# EAGLE design Forza (EAGLE 9.6.2)
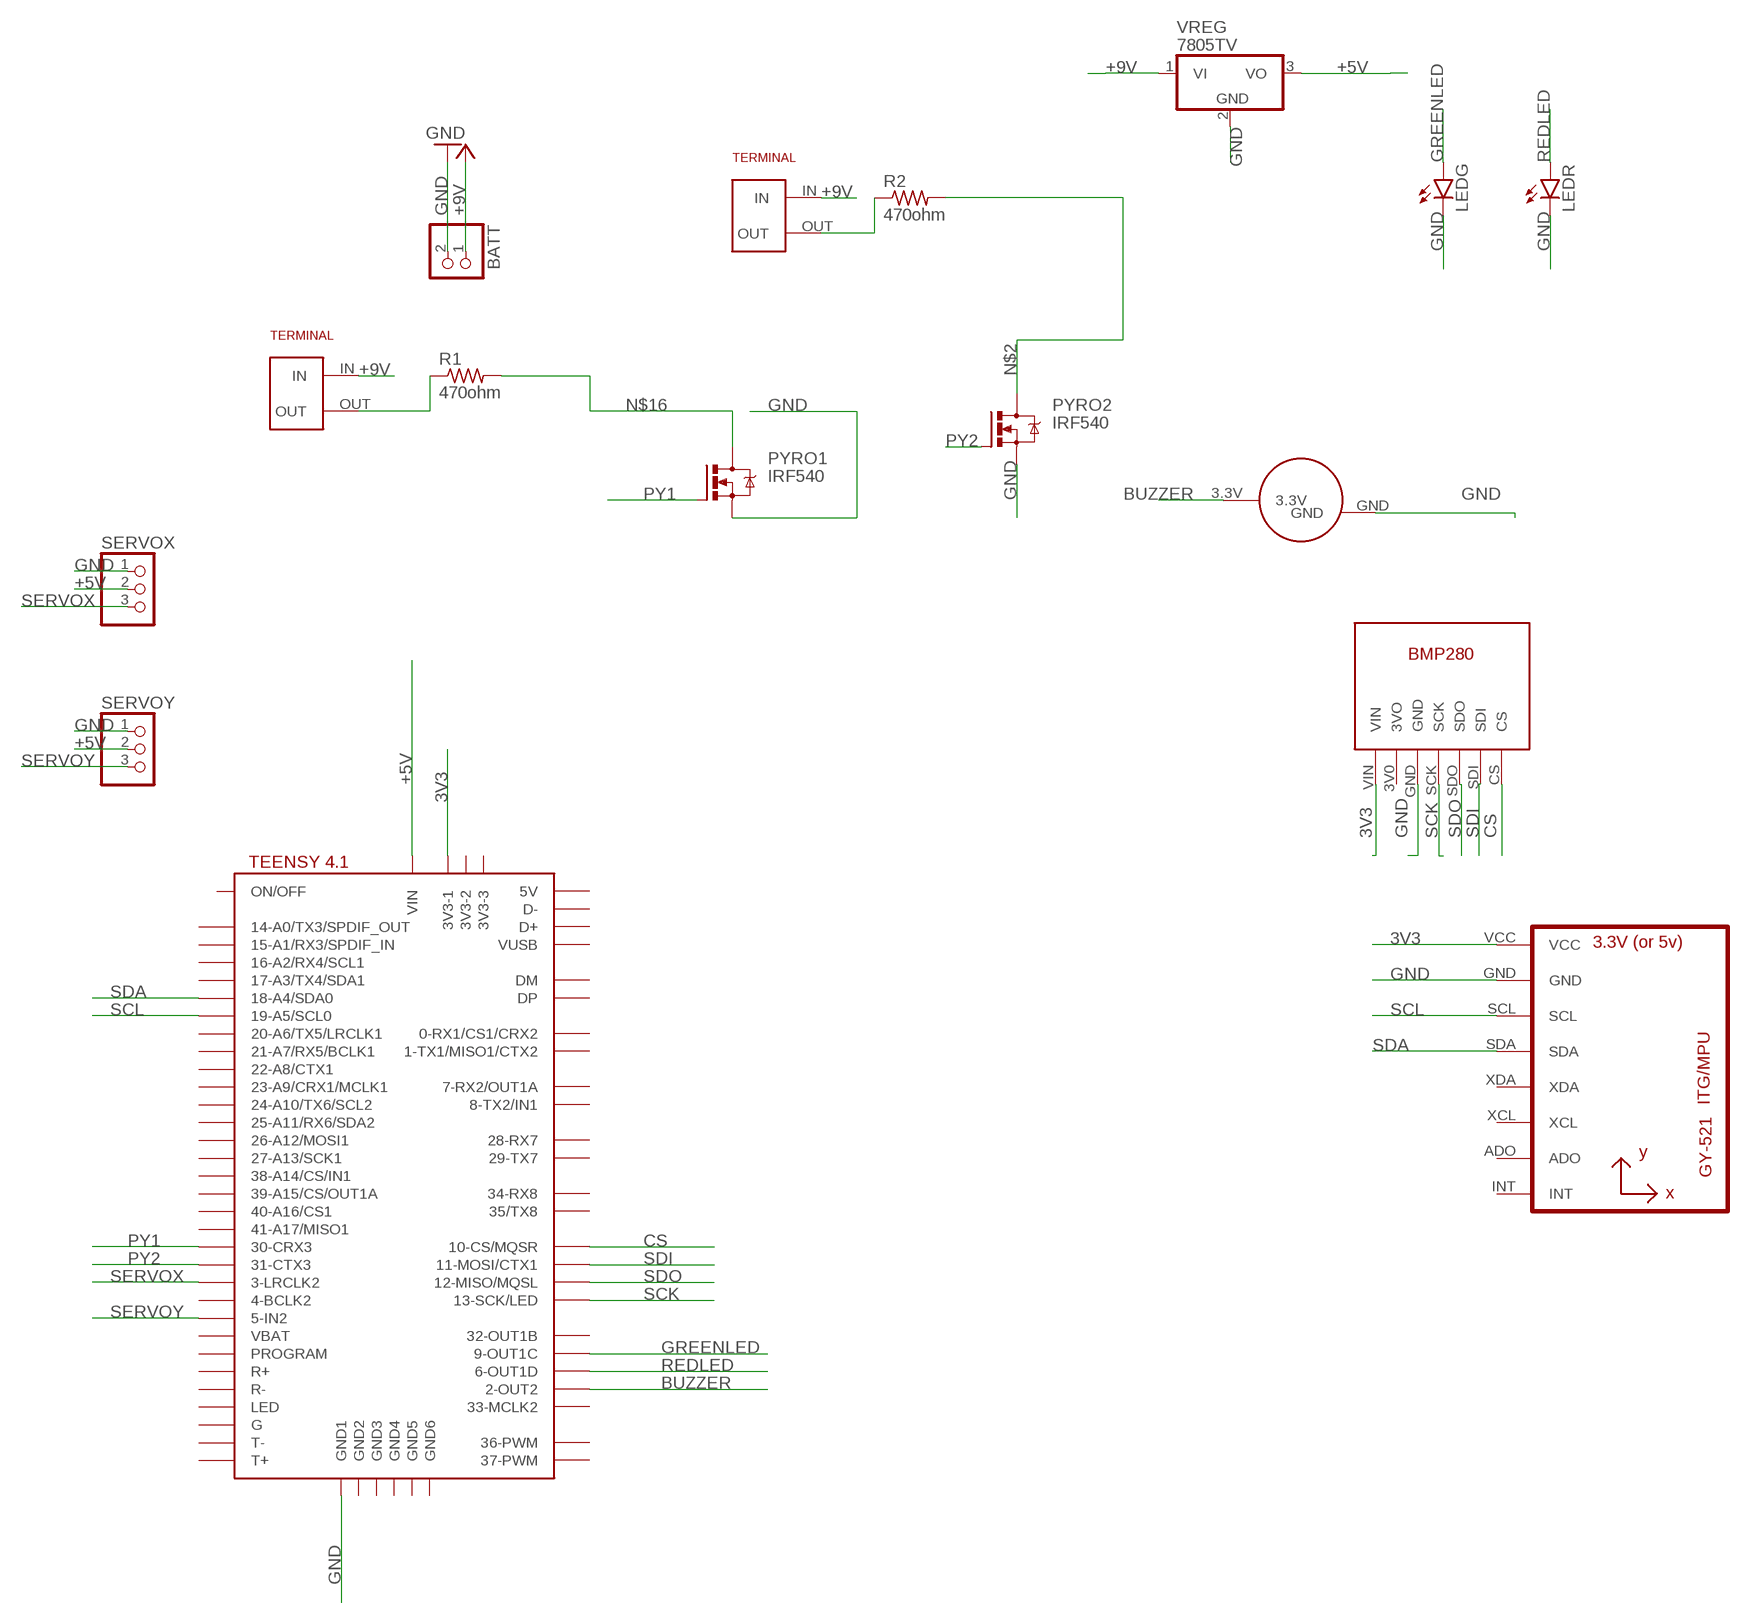
[diagram p0: schematic, sheet 1]

## Parts
BATT  PINHD-1X2  [1X02]
LEDG  LED5MM  [LED5MM]
LEDR  LED5MM  [LED5MM]
PY1  SCREWTERMINAL  [SCREWTERMINAL]
PY2  SCREWTERMINAL  [SCREWTERMINAL]
PYRO1  IRF540  [TO220BV]
PYRO2  IRF540  [TO220BV]
R1  470ohm  R-US_0204/7  [0204/7]
R2  470ohm  R-US_0204/7  [0204/7]
SERVOX  PINHD-1X3  [1X03]
SERVOY  PINHD-1X3  [1X03]
U1  GY-521MPU6050  [GY-521]
U$2  BUZZER  [BUZZER]
U$3  TEENSY41  [TEENSY41]
U$4  BMP280  [BMP280]
VREG  7805TV  [TO220V]

## Nets
3V3: U1.VCC U$3.3V3-1 U$4.VIN
+5V: SERVOX.2 SERVOY.2 U$3.VIN VREG.3(VO)
+9V: BATT.1 PY1.IN PY2.IN VREG.1(VI) ; supply symbol labelled +5V
BUZZER: U$2.3.3V U$3.2-OUT2
CS: U$3.10-CS\MQSR(10-CS/MQSR) U$4.CS
GND: BATT.2 LEDG.K(C) LEDR.K(C) PYRO1.S PYRO2.S SERVOX.1 SERVOY.1 U1.GND U$2.GND U$3.GND1 U$4.GND VREG.2(GND)
GREENLED: LEDG.A U$3.9-OUT1C
N$1: PY1.OUT R1.1
N$2: PYRO2.D R2.2
N$3: PY2.OUT R2.1
N$16: PYRO1.D R1.2
PY1: PYRO1.G U$3.30-CRX3
PY2: PYRO2.G U$3.31-CTX3
REDLED: LEDR.A U$3.6-OUT1D
SCK: U$3.13-SCK/LED U$4.SCK
SCL: U1.SCL U$3.19-A5/SCL0
SDA: U1.SDA U$3.18-A4/SDA0
SDI: U$3.11-MOSI/CTX1 U$4.SDI
SDO: U$3.12-MISO/MQSL U$4.SDO
SERVOX: SERVOX.3 U$3.3-LRCLK2
SERVOY: SERVOY.3 U$3.5-IN2
Unconnected: U1.ADO U1.INT U1.XCL U1.XDA U$3.0-RX1/CS1/CRX2 U$3.1-TX1/MISO1/CTX2 U$3.3V3-2 U$3.3V3-3 U$3.4-BCLK2 U$3.7-RX2/OUT1A U$3.8-TX2/IN2(8-TX2/IN1) U$3.14-A0/TX3/SPDIF_OUT U$3.15-A1/RX3/SPDIF_IN U$3.16-A2/RX4/SCL1 U$3.17-A3/TX4/SDA1 U$3.20-A6/TX5/LRCLK1 U$3.21-A7/RX5/BCLK1 U$3.22-A8/CTX1 U$3.23-A9/CRX1/MCLK1 U$3.24-A10/TX6/SCL2 U$3.25-A11/RX6/SDA2 U$3.26-A12/MOSI1 U$3.27-A13/SCK1 U$3.28-RX7 U$3.29-TX7 U$3.32-OUT1B U$3.33-MCLK2 U$3.34-RX8 U$3.35-TX8(35/TX8) U$3.36-PWM U$3.37-PWM U$3.38-A14/CS/IN1 U$3.39-A15/CS/OUT1A U$3.40-A16/CS1 U$3.41-A17/MISO1 U$3.+5V(5V) U$3.D+ U$3.D- U$3.DM U$3.DP U$3.G U$3.GND2 U$3.GND3 U$3.GND4 U$3.GND5 U$3.GND6 U$3.LED U$3.ON/OFF U$3.PROGRAM U$3.R+ U$3.R- U$3.T+ U$3.T- U$3.VBAT U$3.VUSB U$4.3V0(3VO)

## Library data of the parts
BATT = pinhead:PINHD-1X2: PIN HEADER
LEDG LEDR = led:LED: LED OSRAM: - CHIPLED LG R971, LG N971, LY N971, LG Q971, LY Q971, LO R971, LY R971 LH N974, LH R974 LS Q976, LO Q976, LY Q976 LO Q996 - Hyper CHIPLED LW Q18S LB Q993, LB Q99A, LB R99A - SideLED LS A670, LO A670, LY A670, LG A670, LP A670 LB A673, LV A673, LT A673, LW A673 LH A674 LY A675 LS A676, LA A676, LO A676, LY A676, LW A676 LS A679, LY A679, LG A679 - Hyper Micro SIDELED® LS Y876, LA Y876, LO Y876, LY Y876 LT Y87S - SmartLED LW L88C, LW L88S LB L89C, LB L89S, LG L890 LS L89K, LO L89K, LY L89K LS L896, LA L896, LO L896, LY L896 - TOPLED LS T670, LO T670, LY T670, LG T670, LP T670 LSG T670, LSP T670, LSY T670, LOP T670, LYG T670 LG T671, LOG T671, LSG T671 LB T673, LV T673, LT T673, LW T673 LH T674 LS T676, LA T676, LO T676, LY T676, LB T676, LH T676, LSB T676, LW T676 LB T67C, LV T67C, LT T67C, LS T67K, LO T67K, LY T67K, LW E67C LS E67B, LA E67B, LO E67B, LY E67B, LB E67C, LV E67C, LT E67C LW T67C LS T679, LY T679, LG T679 LS T770, LO T770, LY T770, LG T770, LP T770 LB T773, LV T773, LT T773, LW T773 LH T774 LS E675, LA E675, LY E675, LS T675 LS T776, LA T776, LO T776, LY T776, LB T776 LHGB T686 LT T68C, LB T68C - Hyper Mini TOPLED® LB M676 - Mini TOPLED Santana® LG M470 LS M47K, LO M47K, LY M47K Source: http://www.osram.convergy.de LUXEON: - LUMILED® LXK2-PW12-R00, LXK2-PW12-S00, LXK2-PW14-U00, LXK2-PW14-V00 LXK2-PM12-R00, LXK2-PM12-S00, LXK2-PM14-U00 LXK2-PE12-Q00, LXK2-PE12-R00, LXK2-PE12-S00, LXK2-PE14-T00, LXK2-PE14-U00 LXK2-PB12-K00, LXK2-PB12-L00, LXK2-PB12-M00, LXK2-PB14-N00, LXK2-PB14-P00, LXK2-PB14-Q00 LXK2-PR12-L00, LXK2-PR12-M00, LXK2-PR14-Q00, LXK2-PR14-R00 LXK2-PD12-Q00, LXK2-PD12-R00, LXK2-PD12-S00 LXK2-PH12-R00, LXK2-PH12-S00 LXK2-PL12-P00, LXK2-PL12-Q00, LXK2-PL12-R00 Source: www.luxeon.com KINGBRIGHT: KA-3528ASYC Source: www.kingbright.com
PY1 PY2 = screw terminal:SCREWTERMINAL
PYRO1 PYRO2 = transistor-power:IRF540: HEXFET Power MOSFET
R1 R2 = rcl:R-US_: RESISTOR, American symbol; SPICEPREFIX: R
SERVOX SERVOY = pinhead:PINHD-1X3: PIN HEADER
U1 = gy-521:GY-521
U$2 = buzzer:BUZZER
U$3 = teensy401:TEENSY41
U$4 = BMP280:BMP280
VREG = linear:78*: Positive VOLTAGE REGULATOR Source: http://cache.national.com/ds/LM/LM78L05.pdf http://www.fairchildsemi.com/ds/LM/LM7805.pdf

## Board
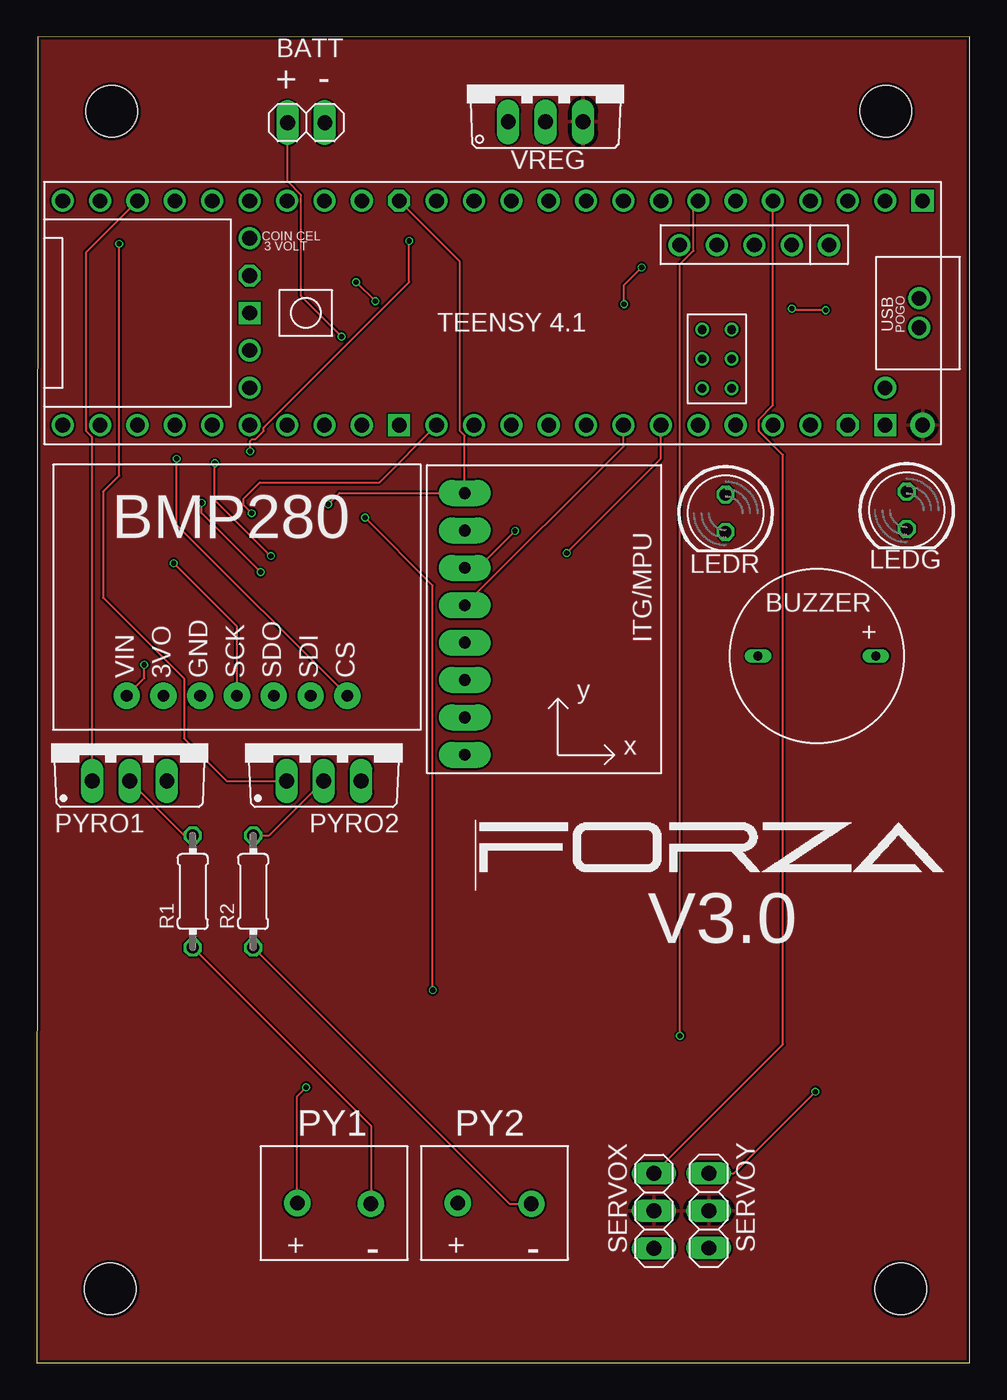
[diagram p1: board, top side]
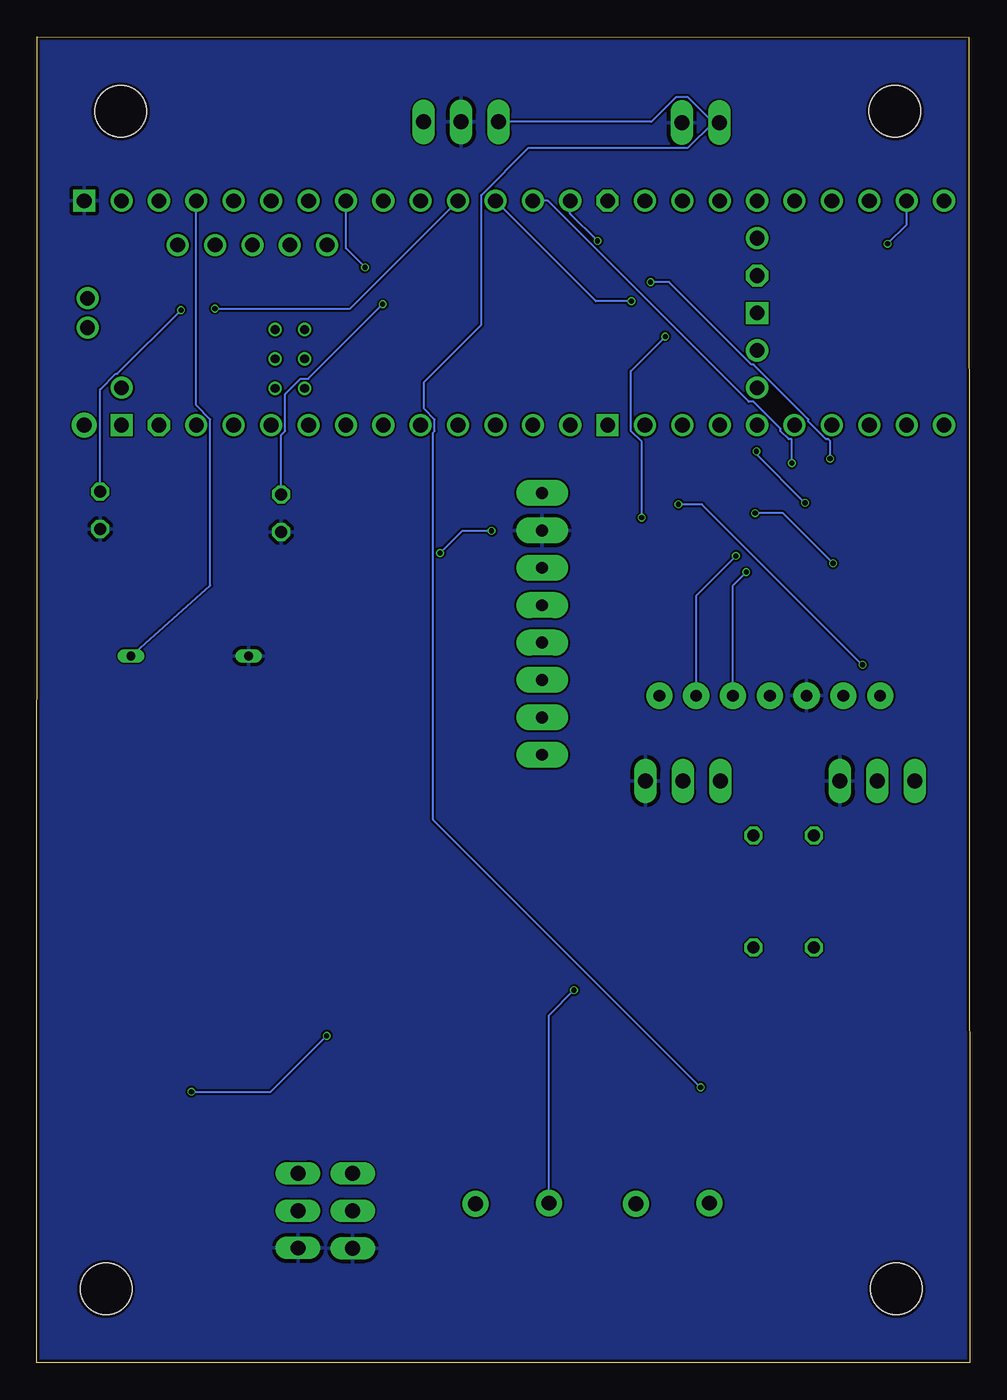
[diagram p2: board, bottom side, seen from below]

Size 63.4 x 90.07 mm. Coordinates in mm from the lower left corner, seen from the top.
Outline: 0,0 63.4,0.01 63.39,90.07 0.07,90.03 0,0
Copper layers (1*16): Top 0.035559375mm / dielectric 1.6mm / Bottom 0.035559375mm
Design rules "jlcpcb2layer": minimum track width 5mil, minimum drill 12mil, track to track 5mil, track to pad 5mil, pad to pad 5mil, via to via 5mil, smd to smd 5mil, copper to edge 8mil, drill to drill 6mil, minimum pad ring 5mil, minimum via ring 3mil, stop-mask expansion 2.5mil, vias tented up to drill 0mil, thermal gap 10mil
Holes 3.5 mm at 57.7,85.01 5.1,85.01 5,5.01 58.7,5.01

### Footprints (pad centres in the part's own frame; a part is rotated, then mirrored left to right if it is on the bottom)
1X02 = drill 1.016 long: 1 -1.27,0; 2 1.27,0
LED5MM = drill 0.813 octagon: A -1.27,0; K 1.27,0
SCREWTERMINAL = drill 1 pad 1.778: IN 3.85,7.5; OUT 3.8,2.5
TO220BV = drill 1.016 long: D 0,-2.54; G -2.54,-2.54; S 2.54,-2.54
0204/7 = drill 0.813 octagon: 1 -3.81,0; 2 3.81,0
1X03 = drill 1.016 long: 1 -2.54,0; 2 0,0; 3 2.54,0
GY-521 = drill 0.8 pad 1.778 long: ADO -8.89,-6.35; GND -8.89,6.35; INT -8.89,-8.89; SCL -8.89,3.81; SDA -8.89,1.27; VCC -8.89,8.89; XCL -8.89,-3.81; XDA -8.89,-1.27
BUZZER = drill 0.6 long: 3.3V 4,0; GND -4,0
TEENSY41 = drill 1: 0-RX1/CS1/CRX2 -27.94,-7.62; 1-TX1/MISO1/CTX2 -25.4,-7.62; 2-OUT2 -22.86,-7.62; 3-LRCLK2 -20.32,-7.62; 4-BCLK2 -17.78,-7.62; 5-IN2 -15.24,-7.62; 6-OUT1D -12.7,-7.62; 7-RX2/OUT1A -10.16,-7.62; 8-TX2/IN2 -7.62,-7.62; 9-OUT1C -5.08,-7.62; 10-CS\MQSR -2.54,-7.62; 11-MOSI/CTX1 0,-7.62; 12-MISO/MQSL 2.54,-7.62; 13-SCK/LED 2.54,7.62; 14-A0/TX3/SPDIF_OUT 0,7.62; 15-A1/RX3/SPDIF_IN -2.54,7.62; 16-A2/RX4/SCL1 -5.08,7.62; 17-A3/TX4/SDA1 -7.62,7.62; 18-A4/SDA0 -10.16,7.62; 19-A5/SCL0 -12.7,7.62; 20-A6/TX5/LRCLK1 -15.24,7.62; 21-A7/RX5/BCLK1 -17.78,7.62; 22-A8/CTX1 -20.32,7.62; 23-A9/CRX1/MCLK1 -22.86,7.62; 24-A10/TX6/SCL2 7.62,-7.62; 25-A11/RX6/SDA2 10.16,-7.62; 26-A12/MOSI1 12.7,-7.62; 27-A13/SCK1 15.24,-7.62; 28-RX7 17.78,-7.62; 29-TX7 20.32,-7.62; 30-CRX3 22.86,-7.62; 31-CTX3 25.4,-7.62; 32-OUT1B 27.94,-7.62; 33-MCLK2 27.94,7.62; 34-RX8 25.4,7.62; 35-TX8 22.86,7.62; 36-PWM 20.32,7.62; 37-PWM 17.78,7.62; 38-A14/CS/IN1 15.24,7.62; 39-A15/CS/OUT1A 12.7,7.62; 40-A16/CS1 10.16,7.62; 41-A17/MISO1 7.62,7.62; +5V -24.13,-4.62; D+ -30.25,-1; D- -30.25,1; DM -21.59,-4.62; DP -19.05,-4.62; GND4 -16.51,-4.62; GND5 -13.97,-4.62; ON/OFF 15.24,5.08; PROGRAM 15.24,2.54; VBAT 15.24,-5.08; VUSB -27.94,5.08 | drill 1 octagon: 3V3-1 5.08,-7.62; 3V3-2 15.24,-2.54; 3V3-3 -25.4,7.62 | drill 0.6: G -15.51,3.12; LED -17.51,3.12; R+ -17.51,5.12; R- -15.51,5.12; T+ -15.51,1.12; T- -17.51,1.12 | drill 1 square: GND1 -30.48,-7.62; GND2 15.24,0; GND3 5.08,7.62; GND6 -27.94,7.62 | drill 1 pad 1.676: VIN -30.48,7.62
BMP280 = drill 0.8 pad 1.778: 3V0 7.5,2.3; CS 20,2.3; GND 10,2.3; SCK 12.5,2.3; SDI 17.5,2.3; SDO 15,2.3; VIN 5,2.3
TO220V = drill 1.016 long: 1 -2.54,-2.54; 2 0,-2.54; 3 2.54,-2.54

### Placement (x,y rotation side)
BATT  18.3,84.25 0 top
LEDG  59.1,57.91 270 top
LEDR  46.8,57.71 270 top
PY1  25.2,6.99 90 top
PY2  36.1,7 90 top
PYRO1  6.3,42.06 0 top
PYRO2  19.5,42.06 0 top
R1  10.6,32.01 90 top
R2  14.7,32.01 90 top
SERVOX  41.93,10.32 90 top
SERVOY  45.66,10.33 90 top
U1  37.96,50.19 0 top
U$2  53,48.01 0 top
U$3  29.7,71.31 180 top
U$4  1.1,43.01 0 top
VREG  34.57,86.83 0 top

### Tracks (layer width: path | path; a pad name or v marks a point on that pad's centre or on a via)
3V3  (via drill 0.35)
  Top 0.152: U$3.3V3-1 28.75,74.8 28.75,63.29 29.07,62.97 U1.VCC 20.57,59.08 v19.8,58.31 | U$4.VIN 7.3,46.51 v7.3,47.41
  Bottom 0.152: v7.3,47.41 18.2,58.31 v19.8,58.31
+5V
  pour Top: -0.3,104.01 -0.3,-12.99 75.7,-12.99 75.7,104.01
+9V  (via drill 0.35)
  Top 0.152: PY1.IN 17.7,18.11 v18.3,18.71 | v26.9,25.31 26.9,52.81 v22.3,57.41 | BATT.1 17.03,80.25 17.95,79.32 17.95,72.46 v20.7,69.71
  Bottom 0.152: 17.44,84.25 19.17,85.98 19.97,85.98 21.66,84.29 VREG.1 | v18.3,18.71 36.47,36.87 36.47,63.19 36.37,63.29 36.37,64.08 37.1,64.82 37.1,66.61 33.19,70.52 33.19,79.32 30,82.52 19.17,82.52 17.44,84.25 | 17.44,84.25 BATT.1 | PY2.IN 28.6,23.61 v26.9,25.31 | v22.3,57.41 22.3,62.56 23.03,63.29 23.03,67.38 v20.7,69.71
BUZZER
  Bottom 0.152: U$3.2-OUT2 52.56,65.04 51.61,64.08 51.61,52.8 U$2.3.3V
CS  (via drill 0.35)
  Top 0.152: v21.7,73.41 v23,72.11 | U$4.CS 9.5,56.91 v9.5,61.41
  Bottom 0.152: v21.7,73.41 20.45,73.41 14.86,67.82 14.7,67.82 10.97,64.08 10.97,63.93 9.78,62.74 9.63,62.74 9.5,62.61 v9.5,61.41 | v23,72.11 25.42,72.11 U$3.10-CS\MQSR
GND
  pour Bottom (isolate 0.016): -2.3,102.01 -2.3,-4.99 67.7,-4.99 67.7,103.01 -1.3,103.01
GREENLED  (via drill 0.35)
  Top 0.152: v53.6,71.51 51.4,71.51 v51.3,71.61
  Bottom 0.152: v53.6,71.51 57.93,67.18 58.04,67.18 59.1,66.12 LEDG.A | v51.3,71.61 42.1,71.61 U$3.9-OUT1C
N$1
  Top 0.152: R1.1 22.7,16.1 PY1.OUT
N$2
  Top 0.152: PYRO2.D 15.8,35.82 R2.2
N$3
  Top 0.152: R2.1 32.1,10.8 PY2.OUT
N$16
  Top 0.152: PYRO1.D 10,35.82 R1.2
PY1
  Top 0.152: PYRO1.G 3.76,62.88 3.35,63.29 3.35,75.44 U$3.30-CRX3
PY2  (via drill 0.35)
  Top 0.152: v5.6,76.01 5.6,60.25 4.51,59.16 4.51,51.97 10.01,46.47 10.01,42.42 10,42.41 12.89,39.52 PYRO2.G
  Bottom 0.152: v5.6,76.01 4.3,77.31 U$3.31-CTX3
REDLED  (via drill 0.35)
  Top 0.152: v39.9,71.91 39.9,73.21 v41.1,74.41
  Bottom 0.152: LEDR.A 46.8,63.02 46.53,63.29 46.53,65.8 45.48,66.84 44.97,66.84 v39.9,71.91 | v41.1,74.41 42.4,75.71 U$3.6-OUT1D
SCK  (via drill 0.35)
  Top 0.152: U$3.13-SCK/LED 23.27,59.8 15.15,59.8 14.06,58.71 14.06,58.25 v14.6,57.71 | U$4.SCK 13.6,50.01 v9.3,54.31
  Bottom 0.152: v9.3,54.31 12.7,57.71 v14.6,57.71
SCL  (via drill 0.35)
  Top 0.152: U1.SCL 29.99,54 v32.5,56.51 | v36,55.01 42.4,61.41 U$3.19-A5/SCL0
  Bottom 0.152: v32.5,56.51 34.5,56.51 v36,55.01
SDA
  Top 0.152: U1.SDA 39.86,62.25 U$3.18-A4/SDA0
SDI  (via drill 0.35)
  Top 0.152: v15.9,54.81 12.1,58.61 v12.1,61.11
  Bottom 0.152: U$3.11-MOSI/CTX1 28.68,78.93 15.03,65.28 14.7,65.28 12.87,63.45 12.87,63.29 12.32,62.74 12.13,62.74 12.1,62.71 v12.1,61.11 | U$4.SDI 18.6,52.11 v15.9,54.81
SDO  (via drill 0.35)
  Top 0.152: v25.3,76.21 25.3,73.41 15.41,63.52 15.41,63.29 14.86,62.74 14.63,62.74 14.5,62.61 v14.5,61.91 | v15.2,53.71 11.2,57.71 v11.2,58.41
  Bottom 0.152: v25.3,76.21 27.16,78.07 U$3.12-MISO/MQSL | U$4.SDO 16.1,52.81 v15.2,53.71 | v11.2,58.41 14.5,61.71 v14.5,61.91
SERVOX
  Top 0.152: U$3.3-LRCLK2 50.02,65.04 49.07,64.08 49.07,63.29 50.7,61.66 50.7,21.63 SERVOX.3
SERVOY  (via drill 0.35)
  Top 0.152: SERVOY.3 47.36,12.87 v52.9,18.41 | v43.7,22.21 43.7,74.61 44.62,75.53 44.62,78.61 U$3.5-IN2
  Bottom 0.152: v52.9,18.41 47.5,18.41 v43.7,22.21

### Text on the board
tNames: + | - | V3.0 | PY1 | PY2